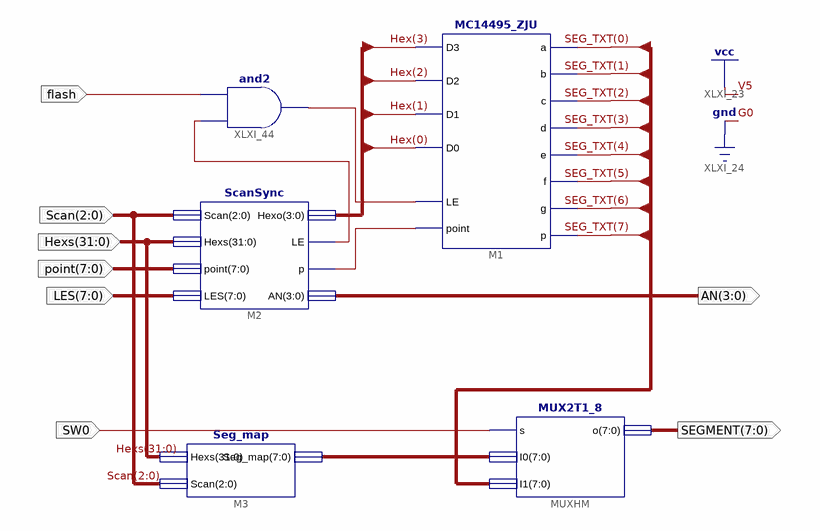
[diagram p0: schematic sheet 1]
// Xilinx ISE schematic Seg7_Dev.sch (kintex7) as structural Verilog: 5 symbols, 8 ports
module Seg7_Dev (
  input  flash,
  input  [2:0] Scan,
  input  [31:0] Hexs,
  input  [7:0] point,
  input  [7:0] LES,
  input  SW0,
  output [3:0] AN,
  output [7:0] SEGMENT
);

  wire XLXN_401, XLXN_402, XLXN_403;
  wire [3:0] Hex;
  wire [7:0] SEG_MAP, SEG_TXT;

  MC14495_ZJU M1 (
    .a(SEG_TXT[0]), .b(SEG_TXT[1]), .c(SEG_TXT[2]), .d(SEG_TXT[3]), .e(SEG_TXT[4]), .f(SEG_TXT[5]),
    .g(SEG_TXT[6]), .p(SEG_TXT[7]), .D3(Hex[3]), .D2(Hex[2]), .D1(Hex[1]), .D0(Hex[0]), .point(XLXN_402),
    .LE(XLXN_403));
  ScanSync M2 (.point(point), .LES(LES), .LE(XLXN_401), .AN(AN), .Scan(Scan), .Hexs(Hexs), .Hexo(Hex), .p(XLXN_402));
  and XLXI_44 (XLXN_403, XLXN_401, flash);
  Seg_map M3 (.Hexs(Hexs), .Scan(Scan), .Seg_map(SEG_MAP));
  MUX2T1_8 MUXHM (.s(SW0), .I0(SEG_MAP), .I1(SEG_TXT), .o(SEGMENT));
endmodule
